# EAGLE design Procesor-ESP8266 (EAGLE 9.4.0)
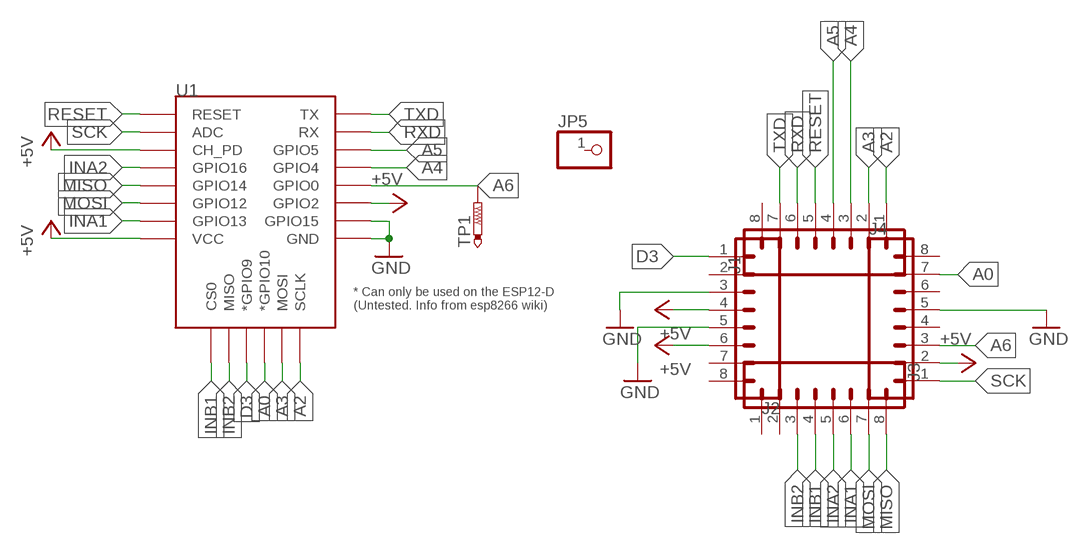
[diagram p0: schematic, sheet 1]

## Parts
J1  CONN_08SMD-STRAIGHT-ALT-FEMALE  [1X08_SMD_ALT]
J2  CONN_08SMD-STRAIGHT-ALT-FEMALE  [1X08_SMD_ALT]
J3  CONN_08SMD-STRAIGHT-ALT-FEMALE  [1X08_SMD_ALT]
J4  CONN_08SMD-STRAIGHT-ALT-FEMALE  [1X08_SMD_ALT]
JP5  PINHD-1X1  [1X01]
TP1  PTR1B1,27  [B1,27]
U1  ESP12ESMD  [ESP12E-SMD]

## Nets
+5V: J2.4 J2.6 J4.2 U1.CH_PD U1.GPIO2 U1.VCC
A0: J4.7 U1.GPIO10(*GPIO10)
A2: J1.1 U1.SCLK
A3: J1.2 U1.MOSI
A4: J1.3 U1.GPIO4
A5: J1.4 U1.GPIO5
A6: J4.3 TP1.TP U1.GPIO0
D3: J2.1 U1.GPIO9(*GPIO9)
GND: J2.3 J2.5 J4.5 U1.GND U1.GPIO15
INA1: J3.6 U1.GPIO13
INA2: J3.5 U1.GPIO16
INB1: J3.4 U1.CS0
INB2: J3.3 U1.MISO
MISO: J3.8 U1.GPIO14
MOSI: J3.7 U1.GPIO12
RESET: J1.5 U1.RESET
RXD: J1.6 U1.RXD0(RX)
SCK: J4.1 U1.ADC
TXD: J1.7 U1.TXD0(TX)
Unconnected: J1.8 J2.2 J2.7 J2.8 J3.1 J3.2 J4.4 J4.6 J4.8 JP5.1

## Library data of the parts
J1-J4 = SparkFun-Connectors:CONN_08: Multi connection point. Often used as Generic Header-pin footprint for 0.1 inch spaced/style header connections On any of the 0.1 inch spaced packages, you can populate with these: Break Away Headers - Straight <https://www.sparkfun.com/products/116> (PRT-00116) Break Away Male Headers - Right Angle <https://www.sparkfun.com/products/553> (PRT-00553) Female Headers <https://www.sparkfun.com/products/115> (PRT-00115) Break Away Headers - Machine Pin <https://www.sparkfun.com/products/117> (PRT-00117) Break Away Female Headers - Swiss Machine Pin <https://www.sparkfun.com/products/743> (PRT-00743) Arduino Stackable Header - 8 Pin <https://www.sparkfun.com/products/9279> (PRT-09279) For SCREWTERMINALS and SPRING TERMINALS visit here: Screw Terimnals on SparkFun.com <https://www.sparkfun.com/search/results?term=Screw+Terminals> (5mm/3.5mm/2.54mm spacing) This device is also useful as a general connection point to wire up your design to another part of your project. Our various solder wires solder well into these plated through hole pads. Hook-Up Wire - Assortment (Stranded, 22 AWG) <https://www.sparkfun.com/products/11375> (PRT-11375) Hook-Up Wire - Assortment (Solid Core, 22 AWG) <https://www.sparkfun.com/products/11367> (PRT-11367) View the entire wire category on our website here <https://www.sparkfun.com/categories/141> Special notes: Molex polarized connector foot print use with SKU : PRT-08231 with associated crimp pins and housings. 1MM SMD Version SKU: PRT-10208 NOTES ON THE VARIANTS LOCK and LOCK_LONGPADS... This footprint was designed to help hold the alignment of a through-hole component (i.e. 6-pin header) while soldering it into place. You may notice that each hole has been shifted either up or down by 0.005 of an inch from it's more standard position (which is a perfectly straight line). This slight alteration caused the pins (the squares in the middle) to touch the edges of the holes. Because they are alternating, it causes a "brace" to hold the component in place. 0.005 has proven to be the perfect amount of "off-center" position when using our standard breakaway headers. Although looks a little odd when you look at the bare footprint, once you have a header in there, the alteration is very hard to notice. Also,if you push a header all the way into place, it is covered up entirely on the bottom side.; PROD_ID: CONN-10204; SF_ID: PRT-11543
JP5 = pinhead:PINHD-1X1: PIN HEADER
TP1 = testpad:PTR1: TEST PIN
U1 = esp12e:ESP12E: ESP12E Module

## Board
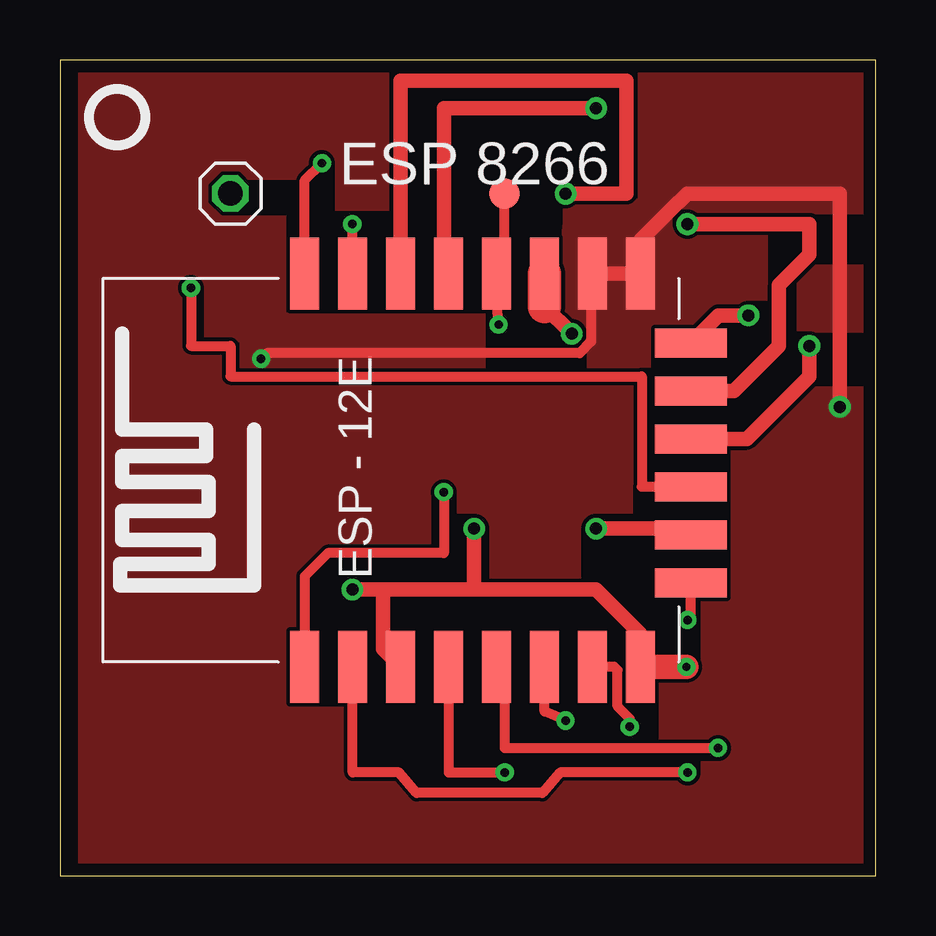
[diagram p1: board, top side]
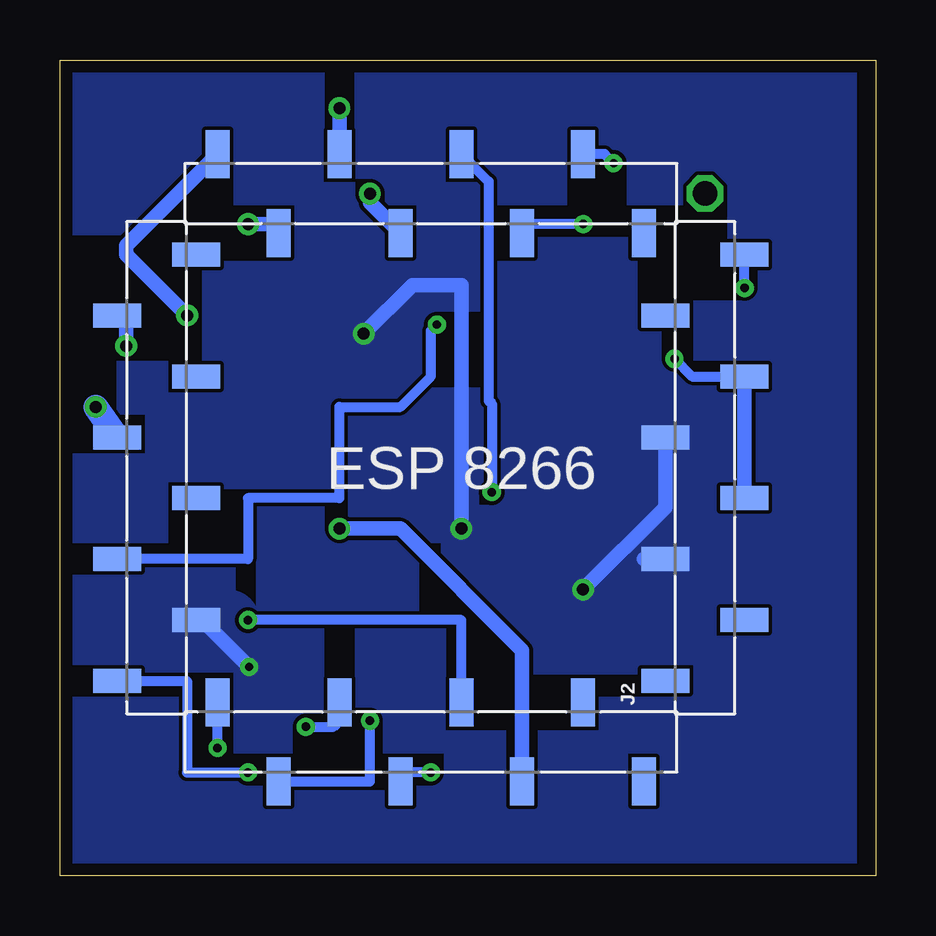
[diagram p2: board, bottom side, seen from below]

Size 34 x 34 mm. Coordinates in mm from the lower left corner, seen from the top.
Outline: 0,0 34,0 34,34 0,34 0,0
Copper layers (1*16): Top 0.035mm / dielectric 1.5mm / Bottom 0.035mm
Design rules "default *": minimum track width 6mil, minimum drill 0.35mm, track to track 6mil, track to pad 6mil, pad to pad 6mil, via to via 6mil, smd to smd 6mil, copper to edge 20mil, drill to drill 6mil, minimum pad ring 10mil, minimum via ring 8mil, stop-mask expansion 4mil, vias tented up to drill 0mil, thermal gap 10mil

### Footprints (pad centres in the part's own frame; a part is rotated, then mirrored left to right if it is on the bottom)
1X08_SMD_ALT = smd 1 x 2: 1 0,-1.65; 2 -2.54,1.65; 3 -5.08,-1.65; 4 -7.62,1.65; 5 -10.16,-1.65; 6 -12.7,1.65; 7 -15.24,-1.65; 8 -17.78,1.65
1X01 = drill 1.016 octagon: 1 0,0
B1,27 = smd 1.27 x 1.27: TP 0,0
ESP12E-SMD = smd 3 x 1.2: ADC -8.3,3.8; CH_PD -8.3,1.8; GND 8.1,-8.2; GPIO0 8.1,-2.2; GPIO2 8.1,-4.2; GPIO4 8.1,-0.2; GPIO5 8.1,1.8; GPIO12 -8.3,-4.2; GPIO13 -8.3,-6.2; GPIO14 -8.3,-2.2; GPIO15 8.1,-6.2; GPIO16 -8.3,-0.2; RESET -8.3,5.8; RXD0 8.1,3.8; TXD0 8.1,5.8; VCC -8.3,-8.2 | smd 1.2 x 3: CS0 -4.8,-10.3; GPIO9 -0.8,-10.3; GPIO10 1.2,-10.3; MISO -2.8,-10.3; MOSI 3.2,-10.3; SCLK 5.2,-10.3

### Placement (x,y rotation side)
J1  27.43,28.43 180 bottom
J2  7.11,25.89 90 bottom
J3  9.65,5.57 0 bottom
J4  29.97,8.11 270 bottom
JP5  7.11,28.43 0 top
TP1  18.54,28.43 0 top
U1  16,17 90 top

### Tracks (layer width: path | path; a pad name or v marks a point on that pad's centre or on a via)
+5V  (via drill 0.35, 0.5 pad 0.9)
  Top 0.61: U1.VCC 24.2,10.07 22.35,11.92 17.27,11.92 | 13.46,11.92 13.46,9.44 U1.CH_PD | 13.46,11.92 17.27,11.92 | 20.2,23.72 v21.33,22.59 | 13.46,11.92 v12.19,11.92 | 17.27,11.92 v17.27,14.46
  Top 1.016: U1.VCC v26.12,8.7
  Top 1.4: U1.GPIO2 20.2,23.72
  Bottom 0.61: J2.6 9.65,13.19 | v21.33,22.59 19.3,24.62 17.27,24.62 v17.27,14.46 | v12.19,11.92 8.76,15.35 J2.4 | J4.2 28.06,10.65 v26.12,8.7
  pour Bottom: 40.13,65.26 40.13,-0.3 2.03,-0.3 2.03,65.26
A0  (via drill 0.5 pad 0.9)
  Top 0.61: U1.GPIO10 28.63,18.2 31.24,20.81 v31.24,22.08
  Bottom 0.61: v31.24,22.08 31.24,22.97 J4.7
A2  (via drill 0.5 pad 0.9)
  Top 0.61: v28.7,23.35 27.45,23.35 26.65,22.55 U1.SCLK
  Bottom 0.61: J1.1 31.24,26.27 31.24,25.89 v28.7,23.35
A3  (via drill 0.5 pad 0.9)
  Top 0.61: U1.MOSI 28.09,20.2 29.97,22.08 29.97,24.62 31.24,25.89 31.24,27.16 v26.16,27.16
  Bottom 0.61: v26.16,27.16 25.27,27.16 J1.2
A4  (via drill 0.5 pad 0.9)
  Top 0.61: U1.GPIO4 16,25.3 16,31.99 v22.35,31.99
  Bottom 0.61: v22.35,31.99 J1.3
A5  (via drill 0.5 pad 0.9)
  Top 0.61: U1.GPIO5 14.2,33.13 23.62,33.13 23.62,28.43 v21.08,28.43
  Bottom 0.61: v21.08,28.43 21.08,28.05 J1.4
A6  (via drill 0.35)
  Top 0.406: TP1.TP 18.54,25.44 U1.GPIO0 18.2,23.69 v18.29,22.97
  Bottom 0.406: J4.3 26.16,13.19 26.16,15.73 22.35,15.73 22.35,19.54 19.81,19.54 18.54,20.81 18.54,22.71 v18.29,22.97
D3  (via drill 0.35)
  Top 0.406: U1.GPIO9 24.26,16.2 24.26,20.81 7.11,20.81 7.11,22.08 5.46,22.08 v5.46,24.49
  Bottom 0.406: v5.46,24.49 J2.1
GND  (via drill 0.35, 0.5 pad 0.9)
  Top 0.406: U1.GPIO15 22.14,25.04 22.14,22.25 21.67,21.78 8.62,21.78 v8.38,21.54
  Top 0.61: U1.GPIO15 U1.GND 24.2,26.49 25.78,28.07 25.8,28.07 26.16,28.43 32.51,28.43 v32.51,19.54
  Bottom 0.406: v8.38,21.54 7.65,20.81 J2.3
  Bottom 0.61: J2.3 J2.5
  Bottom 1.016: J4.5 v32.51,19.54
  pour Top: 2.03,65.26 40.13,65.26 40.13,-0.3 2.03,-0.3
INA1  (via drill 0.35)
  Top 0.406: U1.GPIO13 23.11,8.7 23.24,8.57 23.24,7.05 23.75,6.55 v23.75,6.21
  Bottom 0.406: J3.6 22.35,6.46 22.6,6.21 v23.75,6.21
INA2  (via drill 0.35)
  Top 0.406: U1.GPIO16 16.2,4.3 v18.54,4.3
  Bottom 0.406: v18.54,4.3 19.81,4.3 J3.5
INB1  (via drill 0.35)
  Top 0.406: v26.16,10.65 26.3,10.65 U1.CS0
  Bottom 0.406: J3.4 17.27,10.65 v26.16,10.65
INB2  (via drill 0.5 pad 0.9)
  Top 0.406: 26.3,14.08 U1.MISO
  Top 0.61: v22.35,14.46 25.92,14.46 26.3,14.08
  Bottom 0.61: J3.3 14.73,9.38 19.81,14.46 v22.35,14.46
MISO  (via drill 0.35)
  Top 0.406: U1.GPIO14 18.54,8.7 18.54,5.32 v27.43,5.32
  Bottom 0.406: v27.43,5.32 J3.8
MOSI  (via drill 0.35)
  Top 0.406: v21.08,6.46 20.2,6.84 U1.GPIO12
  Bottom 0.406: J3.7 21.08,3.92 v21.08,6.46
RESET  (via drill 0.35)
  Top 0.406: v16,15.98 16,13.44 11.17,13.44 10.2,12.47 U1.RESET
  Bottom 0.406: J1.5 16.13,28.94 16.13,19.79 16,19.67 v16,15.98
RXD  (via drill 0.35)
  Top 0.406: U1.RXD0 v12.2,27.15 v12.19,27.16
  Bottom 0.406: v12.19,27.16 14.73,27.16 J1.6
SCK  (via drill 0.35)
  Top 0.406: v26.16,4.3 20.85,4.3 20.11,3.44 14.87,3.44 14.14,4.3 12.2,4.3 U1.ADC
  Bottom 0.406: J4.1 28.7,8.11 28.7,4.3 v26.16,4.3
TXD  (via drill 0.35)
  Top 0.406: U1.TXD0 10.2,28.98 v10.92,29.7
  Bottom 0.406: v10.92,29.7 11.3,30.08 J1.7

### Text on the board
tNames: ESP 8266
bNames: ESP 8266